# Altium project SSTU V3.0.PrjPCB
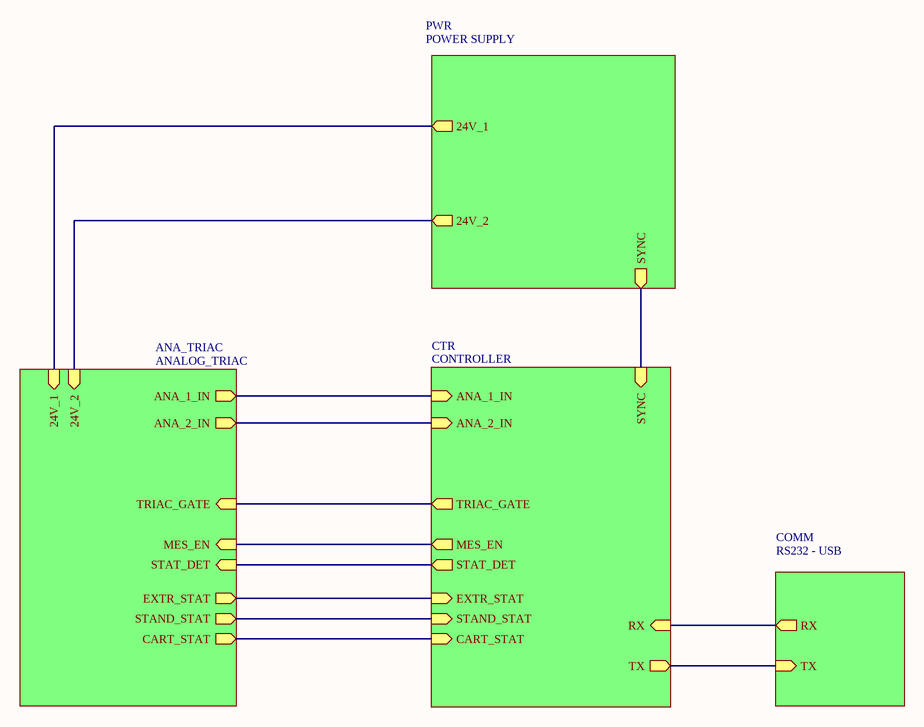
[diagram p0: Main.SchDoc]
4 sheets, 94 parts. Net scope: hierarchical (ports join the sheet entries above them; power ports are global).
Board file: SSTU V3.0.PcbDoc
Sheets:
  Main.SchDoc
    CTR = CONTROLLER.SchDoc
    PWR = POWER SUPPLY.SchDoc
    ANA_TRIAC = ANALOG_TRIAC.SchDoc

## Sheet Main.SchDoc
size A4

### Sub-sheets
ANA_TRIAC = ANALOG_TRIAC: ANA_1_IN (out), CART_STAT (out), ANA_2_IN (out), STAND_STAT (out), EXTR_STAT (out), STAT_DET (in), 24V_1 (in), 24V_2 (in), TRIAC_GATE (in), MES_EN (in)
COMM = RS232 - USB (file not in this document): RX (out), TX (in)
CTR = CONTROLLER: STAT_DET (out), ANA_1_IN (in), RX (in), TX (out), SYNC (in), ANA_2_IN (in), TRIAC_GATE (out), EXTR_STAT (in), STAND_STAT (in), CART_STAT (in), MES_EN (out)
PWR = POWER SUPPLY: SYNC (out), 24V_1 (out), 24V_2 (out)

### Nets
NetC208_1: sheet PWR/24V_1, sheet ANA_TRIAC/24V_1
NetC501_2: sheet CTR/ANA_2_IN, sheet ANA_TRIAC/ANA_2_IN
NetC507_2: sheet CTR/ANA_1_IN, sheet ANA_TRIAC/ANA_1_IN
NetD200_A: sheet PWR/24V_2, sheet ANA_TRIAC/24V_2
NetR201_2: sheet CTR/SYNC, sheet PWR/SYNC
NetR507_1: sheet CTR/TRIAC_GATE, sheet ANA_TRIAC/TRIAC_GATE
NetR522_2: sheet CTR/STAND_STAT, sheet ANA_TRIAC/STAND_STAT
NetR524_2: sheet CTR/CART_STAT, sheet ANA_TRIAC/CART_STAT
NetR526_2: sheet CTR/EXTR_STAT, sheet ANA_TRIAC/EXTR_STAT
NetU400_14: sheet CTR/MES_EN, sheet ANA_TRIAC/MES_EN
NetU400_32: sheet CTR/RX, sheet COMM/RX
NetU400_35: sheet CTR/TX, sheet COMM/TX
NetU400_37: sheet CTR/STAT_DET, sheet ANA_TRIAC/STAT_DET

## Sheet CONTROLLER.SchDoc
size A3
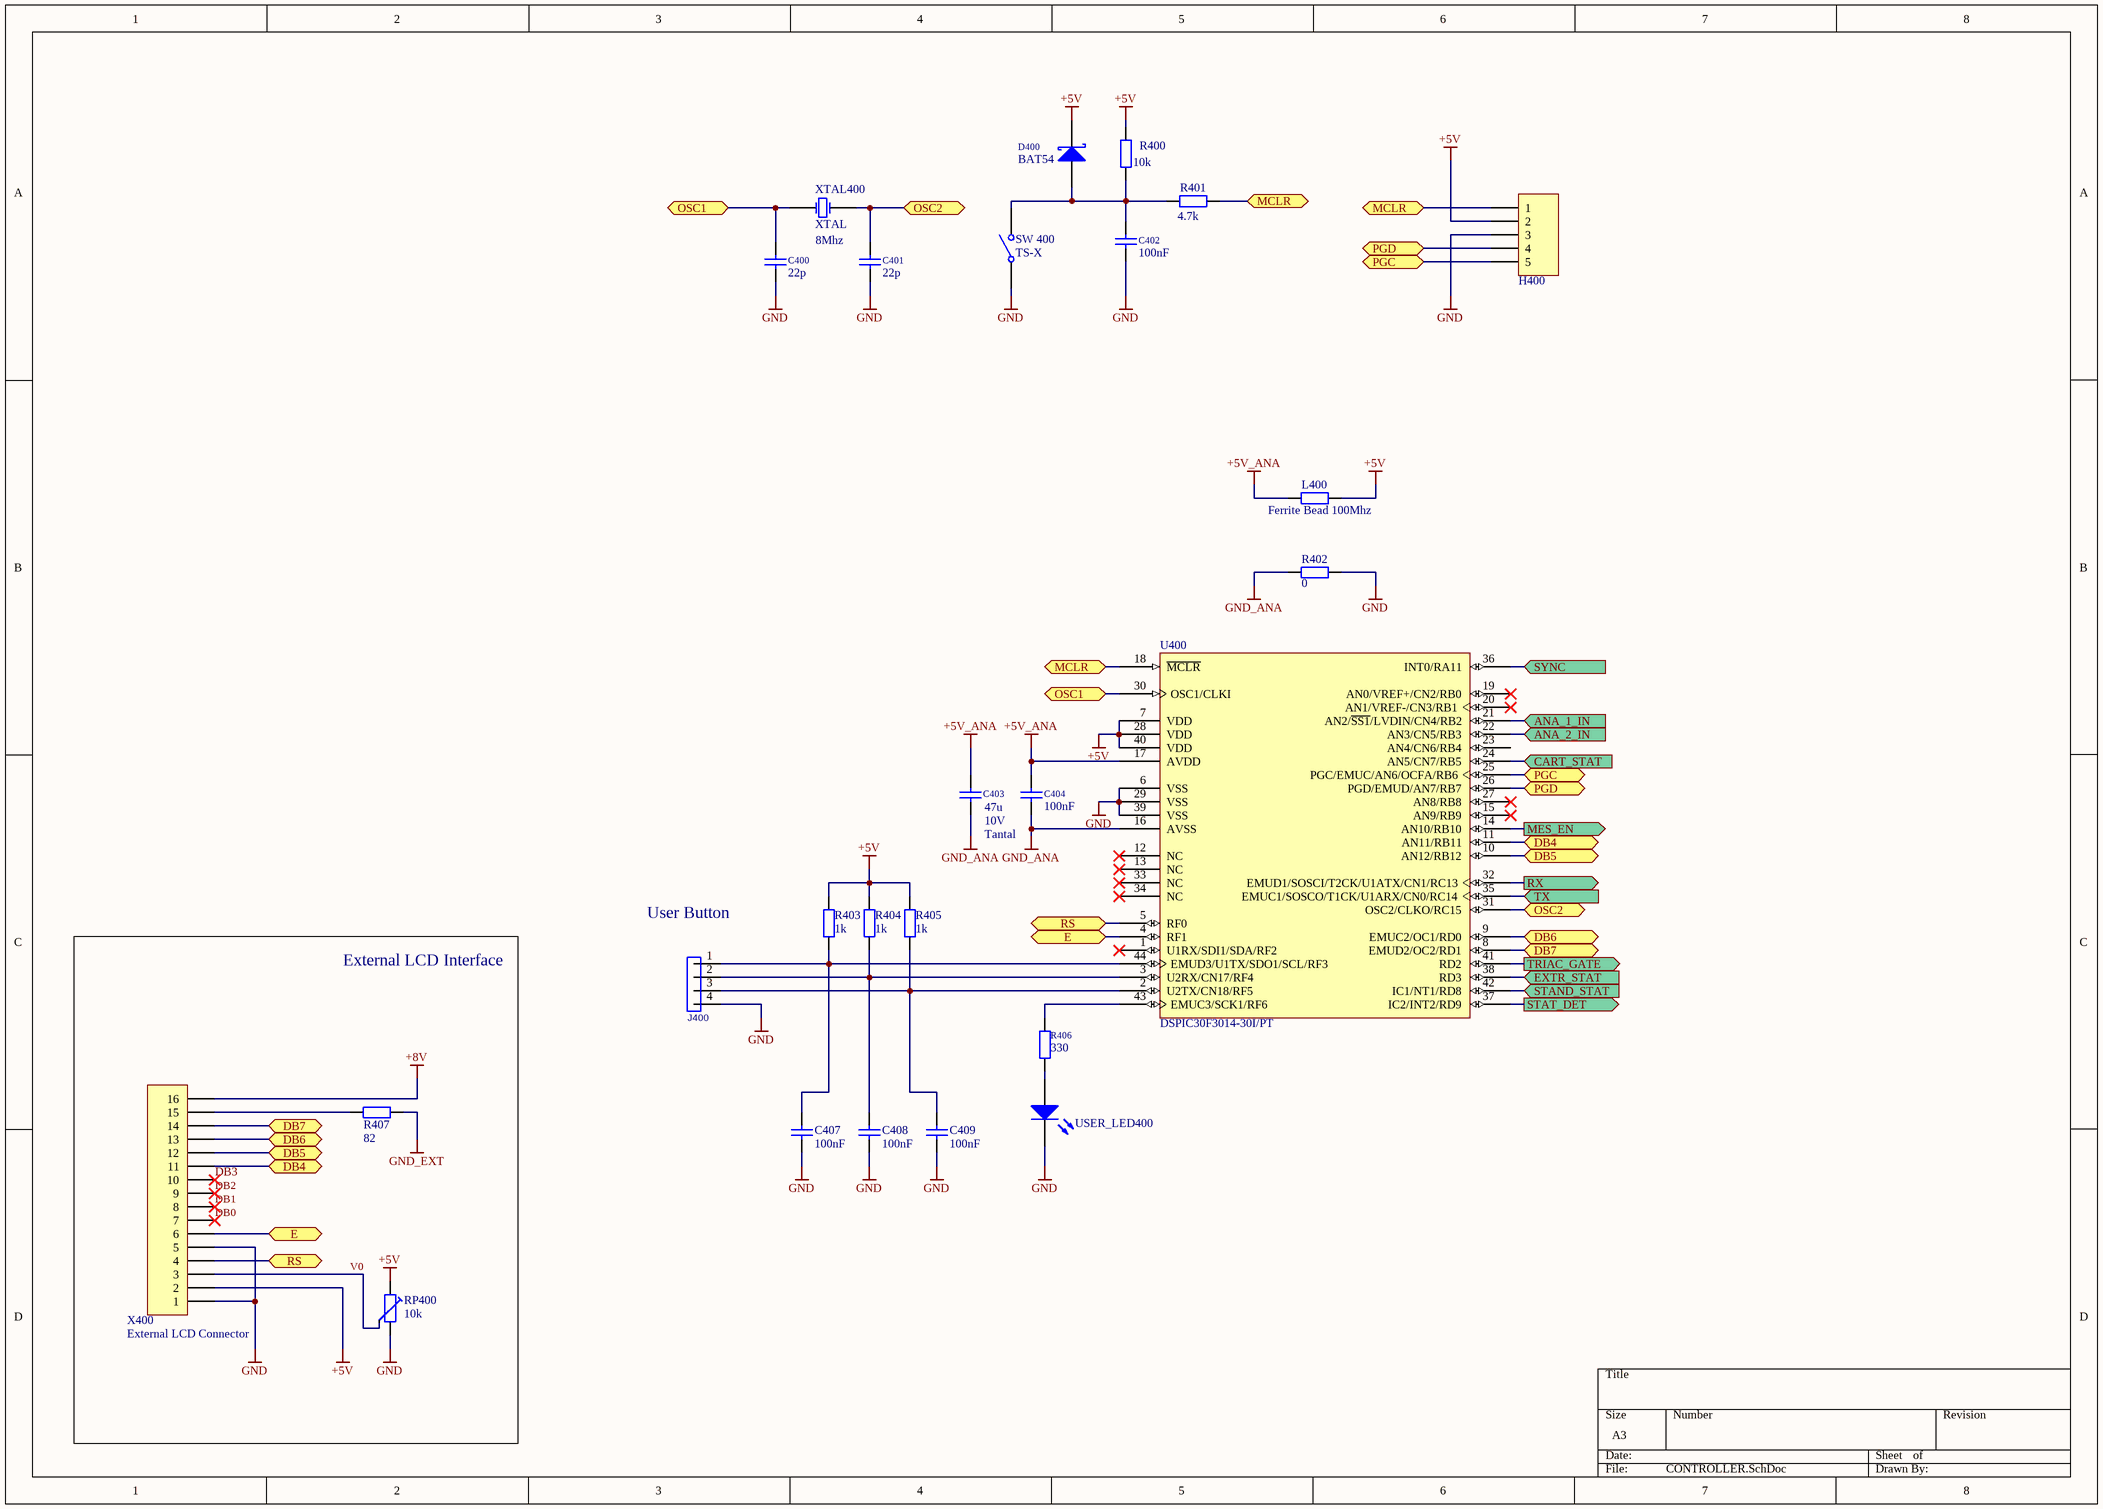
[diagram p1: CONTROLLER.SchDoc]

### Parts
C400  value 22p  [3216[1206]]  (hidden comment: Cap)
C401  value 22p  [3216[1206]]  (hidden comment: Cap)
C402  value 100nF  [3216[1206]]  (hidden comment: Cap)
C403  value 47u  Voltage: 10V  Type: Tantal  [3216[1206]]  (hidden comment: Cap)
C404  value 100nF  [3216[1206]]  (hidden comment: Cap)
C407  value 100nF  [3216[1206]]  (hidden comment: Cap 1206)
C408  value 100nF  [3216[1206]]  (hidden comment: Cap 1206)
C409  value 100nF  [3216[1206]]  (hidden comment: Cap 1206)
D400  BAT54  [SOT23]
H400  HEADER X5  [SIP5]  (value not drawn)
J400  SIP4  [SIP4]  (value not drawn)
L400  value Ferrite Bead 100Mhz  [3216[1206]]  (hidden comment: RES)
R400  value 10k  [3216[1206]]  (hidden comment: RES)
R401  value 4.7k  [3216[1206]]  (hidden comment: RES)
R402  value 0  [3216[1206]]  (hidden comment: RES)
R403  value 1k  [3216[1206]]  (hidden comment: RES)
R404  value 1k  [3216[1206]]  (hidden comment: RES)
R405  value 1k  [3216[1206]]  (hidden comment: RES)
R406  value 330  [3216[1206]]  (hidden comment: Resistor)
R407  value 82  [1206_REFLOW]  (hidden comment: RES)
RP400  value 10k  [BOURNS3296W]  (hidden comment: Trimmer)
SW_400  value TS-X  [TS Button]  (hidden comment: Tack Button 6x6)
U400  DSPIC30F3014-30I/PT  [TQFP-PT44_M]
USER_LED400  LED  [LED_1206]  (value not drawn)
X400  HEADER X16  [HDR1X16]  (value not drawn)
XTAL400  XTAL  value 8Mhz  [XTAL]

### Blocks framed on the sheet
External LCD Interface: R407 RP400 X400

### Ports
ANA_1_IN (in), ANA_2_IN (in), CART_STAT (in), DB4 (bidir), DB5 (bidir), DB6 (bidir), DB7 (bidir), E (bidir), EXTR_STAT (in), MCLR (bidir), MES_EN (out), OSC1 (bidir), OSC2 (bidir), PGC (bidir), PGD (bidir), RS (bidir), RX (out), STAND_STAT (in), STAT_DET (out), SYNC (in), TRIAC_GATE (out), TX (in)

### Nets
+5V: D400.3(K) H400.2 L400.2 R400.1 R403.2 R404.2 R405.2 RP400.3 U400.7(VDD) U400.28(VDD) U400.40(VDD) X400.2
+5V_ANA: C403.2 C404.2 L400.1 U400.17(AVDD)
+8V: X400.16
GND: C400.1 C401.1 C402.1 C407.1 C408.1 C409.1 H400.3 J400.4 R402.2 RP400.1 SW_400.1(COMMON) U400.6(VSS) U400.29(VSS) U400.39(VSS) USER_LED400.K X400.1 X400.5
GND_ANA: C403.1 C404.1 R402.1 U400.16(AVSS)
GND_EXT: R407.2
DB0: X400.7
DB1: X400.8
DB2: X400.9
DB3: X400.10
V0: RP400.2 X400.3
NetC400_2: C400.2 U400.30(OSC1/CLKI) XTAL400.1(OSC1) ; port OSC1
NetC401_2: C401.2 U400.31(OSC2/CLKO/RC15) XTAL400.2(OSC2) ; port OSC2
NetC402_2: C402.2 D400.1(A) R400.2 R401.1 SW_400.4(NO)
NetC407_2: C407.2 J400.1 R403.1 U400.44(EMUD3/U1TX/SDO1/SCL/RF3)
NetC408_2: C408.2 J400.2 R404.1 U400.3(U2RX/CN17/RF4)
NetC409_2: C409.2 J400.3 R405.1 U400.2(U2TX/CN18/RF5)
NetC501_2: U400.22(AN3/CN5/RB3) ; port ANA_2_IN
NetC507_2: U400.21(AN2/~{SS1}/LVDIN/CN4/RB2) ; port ANA_1_IN
NetH400_1: H400.1 R401.2 U400.18(~{MCLR}) ; port MCLR
NetH400_4: H400.4 U400.26(PGD/EMUD/AN7/RB7) ; port PGD
NetH400_5: H400.5 U400.25(PGC/EMUC/AN6/OCFA/RB6) ; port PGC
NetR201_2: U400.36(INT0/RA11) ; port SYNC
NetR406_1: R406.1 U400.43(EMUC3/SCK1/RF6)
NetR406_2: R406.2 USER_LED400.A
NetR407_1: R407.1 X400.15
NetR507_1: U400.41(RD2) ; port TRIAC_GATE
NetR522_2: U400.42(IC1/NT1/RD8) ; port STAND_STAT
NetR524_2: U400.24(AN5/CN7/RB5) ; port CART_STAT
NetR526_2: U400.38(RD3) ; port EXTR_STAT
NetU400_4: U400.4(RF1) X400.6 ; port E
NetU400_5: U400.5(RF0) X400.4 ; port RS
NetU400_8: U400.8(EMUD2/OC2/RD1) X400.14 ; port DB7
NetU400_9: U400.9(EMUC2/OC1/RD0) X400.13 ; port DB6
NetU400_10: U400.10(AN12/RB12) X400.12 ; port DB5
NetU400_11: U400.11(AN11/RB11) X400.11 ; port DB4
NetU400_14: U400.14(AN10/RB10) ; port MES_EN
NetU400_32: U400.32(EMUD1/SOSCI/T2CK/U1ATX/CN1/RC13) ; port RX
NetU400_35: U400.35(EMUC1/SOSCO/T1CK/U1ARX/CN0/RC14) ; port TX
NetU400_37: U400.37(IC2/INT2/RD9) ; port STAT_DET

Not connected (* = marked no-connect by the designer): U400 1(U1RX/SDI1/SDA/RF2)* 12(NC)* 13(NC)* 15(AN9/RB9)* 19(AN0/VREF+/CN2/RB0)* 20(AN1/VREF-/CN3/RB1)* 23(AN4/CN6/RB4) 27(AN8/RB8)* 33(NC)* 34(NC)*

### Notes on the sheet
- (near J400) User Button
- (near X400) External LCD Connector

### Library data of the parts
L400 R400-R405 R407 = RES 1
R406 = RES1
RP400 = Res Trim
SW_400 = TS-X Button
U400 = DSPIC30F3014-30I/PT: High-Performance 16-bit Digital Signal Controller, 24 KB Flash, 2 KB SRAM, 1 KB EEPROM, 44-Pin TQFP, Industrial Temperature; Published: 29-Jan-2009; DatasheetVersion: revF, Apr-2008; PackageVersion: revAW, Oct-2008; PackageReference: TQFP-PT44; Publisher: Altium Limited; PackageDescription: 44-Lead Plastic Thin Quad Flatpack (PT) - 10x10x1mm Body, 2.00mm [TQFP]; Code_JEDEC: MS-026; ComponentLink1Description: Manufacturer Link; ComponentLink1URL: http://www.microchip.com; ComponentLink2Description: Datasheet; ComponentLink2URL: http://ww1.microchip.com/downloads/en/DeviceDoc/70138F.pdf; ComponentLink3Description: Packaging Specification; ComponentLink3URL: http://ww1.microchip.com/downloads/en/PackagingSpec/00049AW.pdf
USER_LED400 = LED: Value: TBD
D400 = BAT54: Value: BAT54
H400 = HEADER X5: Value: HEADER X5
J400 = SIP4: Value: *
X400 = HEADER X16: Value: HEADER X16

## Sheet POWER SUPPLY.SchDoc
size A4
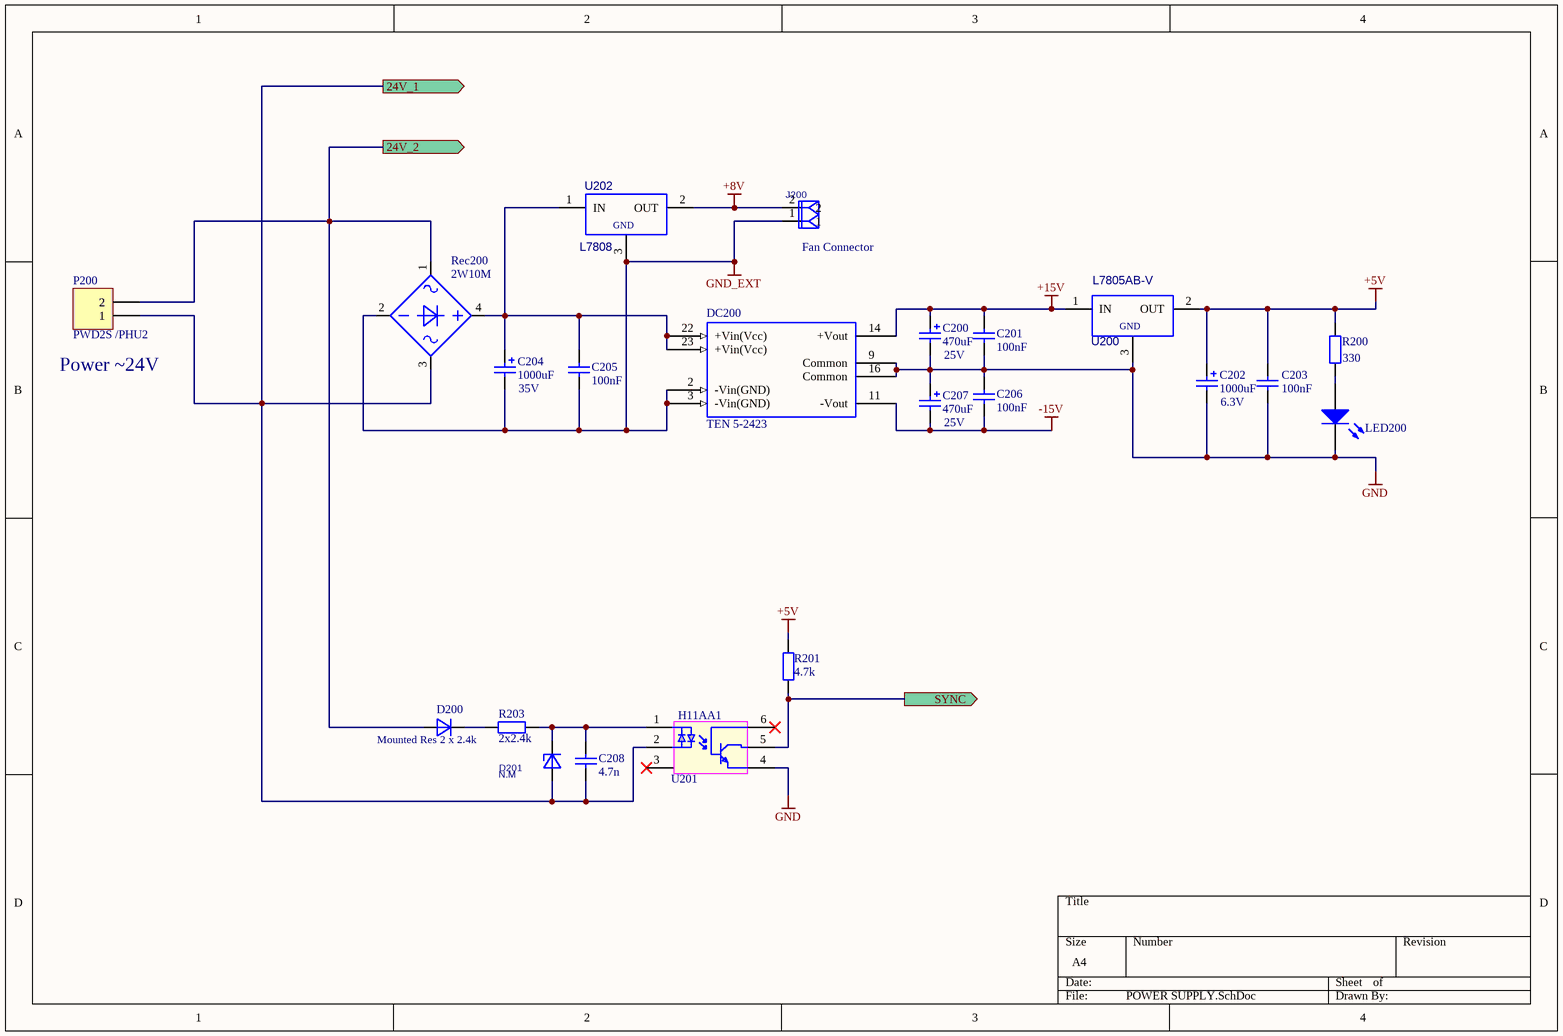
[diagram p2: POWER SUPPLY.SchDoc]

### Parts
C200  value 470uF  Voltage: 25V  [Cap Electrolyt 7]  (hidden comment: Cap)
C201  value 100nF  [3216[1206]]  (hidden comment: Cap 1206)
C202  value 1000uF  Voltage: 6.3V  [Cap Electrolyt 7]  (hidden comment: Cap)
C203  value 100nF  [3216[1206]]  (hidden comment: Cap 1206)
C204  value 1000uF  Voltage: 35V  [Cap Electrolyt 7]  (hidden comment: Cap)
C205  value 100nF  [3216[1206]]  (hidden comment: Cap 1206)
C206  value 100nF  [3216[1206]]  (hidden comment: Cap 1206)
C207  value 470uF  Voltage: 25V  [Cap Electrolyt 7]  (hidden comment: Cap)
C208  value 4.7n  [3216[1206]]  (hidden comment: Cap 1206)
D200  value Mounted Res 2 x 2.4k  [D_MINIMELF_LL4148]  (hidden comment: LL4148)
D201  value N.M  [D_MINIMELF_BZV55C5V1(Primary)]  (hidden comment: BZV55C5V1)
DC200  TEN 5-2423  [DIP24_TRACO]
J200  SIP2  [SIP2]  (value not drawn)
LED200  LED  [LED_1206]  (value not drawn)
P200  PWD2S /PHU2  [PWD2S /PHU2]
R200  value 330  [3216[1206]]  (hidden comment: RES)
R201  value 4.7k  [3216[1206]]  (hidden comment: RES)
R203  value 2x2.4k  [3216[1206]]  (hidden comment: RES)
Rec200  2W10M  [WOB_2WXX[X]M]
U200  value L7805AB-V  [SFM-T3/E10.4V_L7805AC-V(Primary)]  (hidden comment: L7805AC-V)
U201  H11AA1  [DIP6]
U202  value L7808  [SFM-T3/E10.4V_L7805AC-V(Primary)]  (hidden comment: L7805AC-V)

### Ports
24V_1 (out), 24V_2 (out), SYNC (out)

### Nets
+5V: C202.1 C203.2 R200.1 R201.1 U200.2(OUT)
+8V: J200.2 U202.2(OUT)
+15V: C200.1 C201.2 DC200.14(+Vout) U200.1(IN)
-15V: C206.1 C207.2 DC200.11(-Vout)
GND: C200.2 C201.1 C202.2 C203.1 C206.2 C207.1 DC200.9(Common) DC200.16(Common) LED200.K U200.3(GND) U201.4
GND_EXT: C204.2 C205.1 DC200.2(-Vin(GND)) DC200.3(-Vin(GND)) J200.1 Rec200.2(-) U202.3(GND)
NetC204_1: C204.1 C205.2 DC200.22(+Vin(Vcc)) DC200.23(+Vin(Vcc)) Rec200.4(+) U202.1(IN)
NetC208_1: C208.1 D201.A P200.1 Rec200.3(AC2) U201.2 ; port 24V_1
NetC208_2: C208.2 D201.K R203.2 U201.1
NetD200_A: D200.A P200.2 Rec200.1(AC1) ; port 24V_2
NetD200_K: D200.K R203.1
NetLED200_A: LED200.A R200.2
NetR201_2: R201.2 U201.5 ; port SYNC

Not connected (* = marked no-connect by the designer): U201 3* 6*

### Notes on the sheet
- (near J200) Fan Connector
- (near P200) Power |4V

### Library data of the parts
C200 C202 C204 C207 = Cap pol
D201 = BZV55C5V1: Voltage regulator diode; Manufacturer: Any; Group: Discrete; Subgroup1: Zener; Subgroup: Diode; Package: SOD80C; Mounting: SMD
LED200 = LED: Value: TBD
R200 R201 R203 = RES 1
Rec200 = 2W10M: Description: Rectifier; Value: 2W10M
U200 = L7805AC-V: Precision 1A Regulator; ComponentField6: Tab is connected to pin 3 (GND).; ComponentField7: Published 24-Aug-2001; OriginalName: L7805AB-V
U202 = L7805AC-V: Precision 1A Regulator; OriginalName: L7805AB-V; ComponentField6: Tab is connected to pin 3 (GND).; ComponentField7: Published 24-Aug-2001
DC200 = TEN 5-2423: Value: TEN 5-2423
J200 = SIP2: Value: *
P200 = PWD2S /PHU2: Value: PWD2S /PHU2
U201 = H11AA1: Value: H11AA1

## Sheet ANALOG_TRIAC.SchDoc
size A3
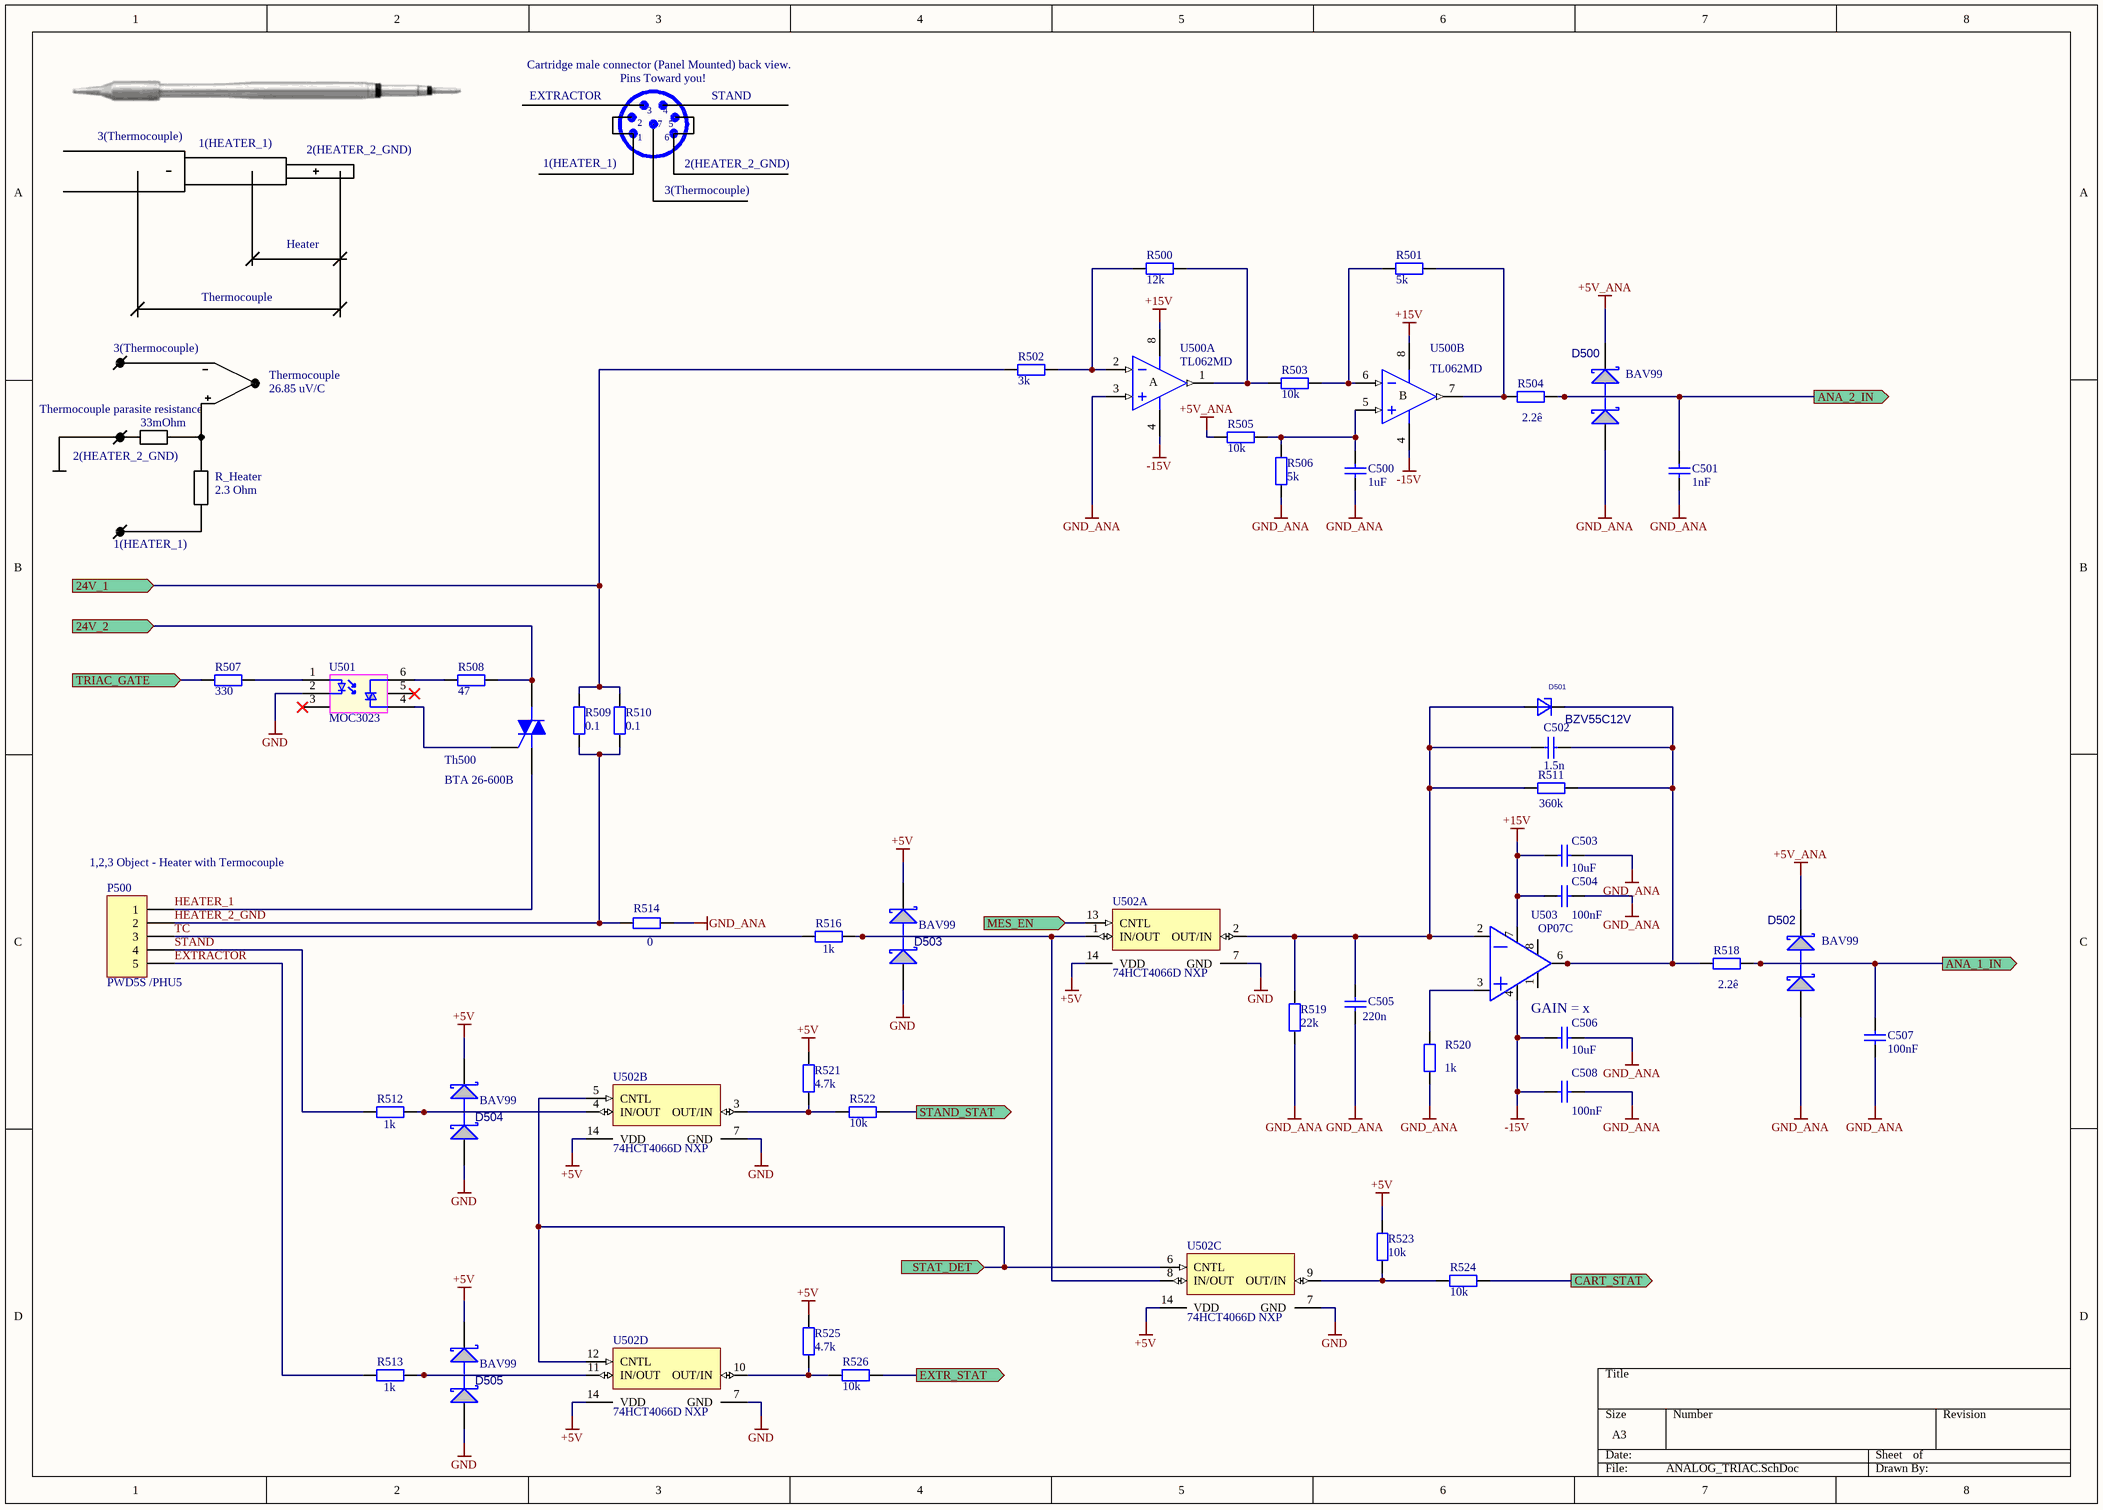
[diagram p3: ANALOG_TRIAC.SchDoc]

### Parts
C500  value 1uF  [3216[1206]]  (hidden comment: Cap 1206)
C501  value 1nF  [3216[1206]]  (hidden comment: Cap 1206)
C502  value 1.5n  [3216[1206]]  (hidden comment: Cap 1206)
C503  value 10uF  [3216[1206]]  (hidden comment: Cap 1206)
C504  value 100nF  [3216[1206]]  (hidden comment: Cap 1206)
C505  value 220n  [3216[1206]]  (hidden comment: Cap 1206)
C506  value 10uF  [3216[1206]]  (hidden comment: Cap 1206)
C507  value 100nF  [3216[1206]]  (hidden comment: Cap 1206)
C508  value 100nF  [3216[1206]]  (hidden comment: Cap 1206)
D500  value BAV99  [SOT23_HIS_Primary]  (hidden comment: BAT64-04)
D501  BZV55C12V  [D_MINIMELF_BZV55C12V(Primary)]
D502  value BAV99  [SOT23_HIS_Primary]  (hidden comment: BAT64-04)
D503  value BAV99  [SOT23_HIS_Primary]  (hidden comment: BAT64-04)
D504  value BAV99  [SOT23_HIS_Primary]  (hidden comment: BAT64-04)
D505  value BAV99  [SOT23_HIS_Primary]  (hidden comment: BAT64-04)
P500  PWD5S /PHU5  [PWD5S/ PHU5]
R500  value 12k  [1206_REFLOW]  (hidden comment: RES)
R501  value 5k  [1206_REFLOW]  (hidden comment: RES)
R502  value 3k  [1206_REFLOW]  (hidden comment: RES)
R503  value 10k  [1206_REFLOW]  (hidden comment: RES)
R504  value 2.2ê  [3216[1206]]  (hidden comment: RES)
R505  value 10k  [1206_REFLOW]  (hidden comment: RES)
R506  value 5k  [1206_REFLOW]  (hidden comment: RES)
R507  value 330  [3216[1206]]  (hidden comment: RES)
R508  value 47  [3216[1206]]  (hidden comment: RES)
R509  value 0.1  [RA161004]  (hidden comment: RES)
R510  value 0.1  [RA161004]  (hidden comment: RES)
R511  value 360k  [3216[1206]]  (hidden comment: RES)
R512  value 1k  [3216[1206]]  (hidden comment: RES)
R513  value 1k  [3216[1206]]  (hidden comment: RES)
R514  value 0  [1206_REFLOW]  (hidden comment: RES)
R516  value 1k  [3216[1206]]  (hidden comment: RES)
R518  value 2.2ê  [3216[1206]]  (hidden comment: RES)
R519  value 22k  [3216[1206]]  (hidden comment: RES)
R520  value 1k  [3216[1206]]  (hidden comment: RES)
R521  value 4.7k  [3216[1206]]  (hidden comment: RES)
R522  value 10k  [3216[1206]]  (hidden comment: RES)
R523  value 10k  [3216[1206]]  (hidden comment: RES)
R524  value 10k  [3216[1206]]  (hidden comment: RES)
R525  value 4.7k  [3216[1206]]  (hidden comment: RES)
R526  value 10k  [3216[1206]]  (hidden comment: RES)
Th500  BTA 26-600B  [TO247]
U500  TL062MD  [SO8_N]  (parts A,B of 2)
U501  MOC3023  [DIP-6]
U502  74HCT4066D NXP  [SO14_N]  (parts A,B,C,D of 4)
U503  OP07C  [SO8]

### Ports
24V_1 (in), 24V_2 (in), ANA_1_IN (out), ANA_2_IN (out), CART_STAT (out), EXTR_STAT (out), MES_EN (in), STAND_STAT (out), STAT_DET (in), TRIAC_GATE (in)

### Nets
+5V: D503.2(K) D504.2(K) D505.2(K) R521.2 R523.2 R525.2 U502.14(VDD)  [also labelled VDD]
+5V_ANA: D500.2(K) D502.2(K) R505.1
+15V: C503.2 C504.2 U500.8(V+) U503.7
-15V: C506.2 C508.2 U500.4(V-) U503.4
GND: D503.1(A) D504.1(A) D505.1(A) U501.2 U502.7(GND)
GND_ANA: C500.1 C501.1 C503.1 C504.1 C505.1 C506.1 C507.1 C508.1 D500.1(A) D502.1(A) R506.1 R514.2 R519.2 R520.2 U500.3(IN+)
EXTRACTOR: P500.5 R513.1
HEATER_1: P500.1 Th500.1
HEATER_2_GND: P500.2 R509.2 R510.2 R514.1
STAND: P500.4 R512.1
TC: P500.3 R516.1
NetC208_1: R502.1 R509.1 R510.1 ; port 24V_1
NetC500_2: C500.2 R505.2 R506.2 U500.5(IN+)
NetC501_2: C501.2 D500.3(C) R504.2 ; port ANA_2_IN
NetC502_1: C502.1 D501.K R511.2 R518.1 U503.6
NetC502_2: C502.2 C505.2 D501.A R511.1 R519.1 U502.2(OUT/IN) U503.2
NetC507_2: C507.2 D502.3(C) R518.2 ; port ANA_1_IN
NetD200_A: R508.2 Th500.2 ; port 24V_2
NetD503_3: D503.3(C) R516.2 U502.1(IN/OUT) U502.8(IN/OUT)
NetD504_3: D504.3(C) R512.2 U502.4(IN/OUT)
NetD505_3: D505.3(C) R513.2 U502.11(IN/OUT)
NetR500_1: R500.1 R502.2 U500.2(IN-)
NetR500_2: R500.2 R503.1 U500.1(OUT)
NetR501_1: R501.1 R503.2 U500.6(IN-)
NetR501_2: R501.2 R504.1 U500.7(OUT)
NetR507_1: R507.1 ; port TRIAC_GATE
NetR507_2: R507.2 U501.1
NetR508_1: R508.1 U501.6
NetR520_1: R520.1 U503.3
NetR521_1: R521.1 R522.1 U502.3(OUT/IN)
NetR522_2: R522.2 ; port STAND_STAT
NetR523_1: R523.1 R524.1 U502.9(OUT/IN)
NetR524_2: R524.2 ; port CART_STAT
NetR525_1: R525.1 R526.1 U502.10(OUT/IN)
NetR526_2: R526.2 ; port EXTR_STAT
NetTh500_3: Th500.3 U501.4
NetU400_14: U502.13(CNTL) ; port MES_EN
NetU400_37: U502.5(CNTL) U502.6(CNTL) U502.12(CNTL) ; port STAT_DET

Not connected (* = marked no-connect by the designer): U501 3* 5*; U503 1 8

### Notes on the sheet
- Cartridge male connector (Panel Mounted) back view.
- EXTRACTOR
- Pins Toward you!
- 3
- 4
- STAND
- 3(Thermocouple)
- 1(HEATER_1)
- 2(HEATER_2_GND)
- 1
- 2
- 7
- 6
- 5
- Heater
- Thermocouple
- Thermocouple parasite resistance
- 33mOhm
- 26.85 uV/C
- 2.3 Ohm
- R_Heater
- (near P500) 1,2,3 Object - Heater with Termocouple
- GAIN = x
- (in symbol TL062MD, part A) A
- (in symbol TL062MD, part B) B

### Library data of the parts
D500 D502-D505 = BAT64-04: Silicon Schottky Diodes; Manufacturer: INF; ComponentLink1DescBC: Manufacturer Link; Group: Discrete; Subgroup: Diode; Published: 21-Mar-2003; DatasheetDocument: Oct-1999; PackageDocument: Sep-2001; PackageReference: SOT-23; Publisher: Altium Limited; ComponentLink1URL: http://www.infineon.com/
R500-R514 R516 R518-R526 = RES 1
U500 = TL062MD: Low-Power J-FET Dual Bipolar Operational Amplifier; Published: 24-Aug-2001; LatestRevisionDate: 13-Apr-2006; LatestRevisionNote: IPC-7351 Footprint Added.; DatasheetVersion: Oct-1997; PackageVersion: Dec-2002; PackageReference: SO8; Publisher: Altium Limited; PackageDescription: 8-Pin Small Outline Integrated Circuit 1.27 mm Pitch; Code_JEDEC: MS-012-AA; Code_IPC: SOIC127P600-8; ComponentLink1Description: Manufacturer Link; ComponentLink1URL: http://www.st.com/; ComponentLink2Description: Datasheet; ComponentLink2URL: http://www.st.com/stonline/products/literature/ds/2294/tl062.pdf
U502 = HCF4066BM1: Quad Bilateral Switch For Transmission or Multiplexing of Analog or Digital Signals; Published: 8-Jun-2000; LatestRevisionDate: 13-Apr-2006; LatestRevisionNote: IPC-7351 Footprint Added.; DatasheetVersion: Jun-1989; PackageVersion: Sep-1998; PackageReference: SO14; Publisher: Altium Limited; PackageDescription: 14-Pin Small Outline Integrated Circuit 1.27 mm Pitch; Code_IPC: SOIC127P600-14; ComponentLink1Description: Manufacturer Link; ComponentLink1URL: http://www.st.com/; ComponentLink2Description: Datasheet; ComponentLink2URL: http://www.st.com/stonline/products/literature/ds/2057/hcf4066.pdf
D501 = BZV55C12V: Value: BZV55C12V
P500 = PWD5S /PHU5: Value: PWD5S /PHU5
Th500 = BTA 26-600B: Value: BTA 26-600B
U501 = MOC3023: Value: MOC3023
U503 = OP07C: Value: OP07C

## Nets that join several sheets
+5V: CONTROLLER (12 pins), POWER SUPPLY (5 pins), ANALOG_TRIAC (7 pins)
+5V_ANA: CONTROLLER (C403.2 C404.2 L400.1 U400.17), ANALOG_TRIAC (D500.2 D502.2 R505.1)
+8V: CONTROLLER (X400.16), POWER SUPPLY (J200.2 U202.2)
+15V: POWER SUPPLY (C200.1 C201.2 DC200.14 U200.1), ANALOG_TRIAC (C503.2 C504.2 U500.8 U503.7)
-15V: POWER SUPPLY (C206.1 C207.2 DC200.11), ANALOG_TRIAC (C506.2 C508.2 U500.4 U503.4)
GND: CONTROLLER (17 pins), POWER SUPPLY (11 pins), ANALOG_TRIAC (5 pins)
GND_ANA: CONTROLLER (C403.1 C404.1 R402.1 U400.16), ANALOG_TRIAC (15 pins)
GND_EXT: CONTROLLER (R407.2), POWER SUPPLY (7 pins)
NetC208_1: POWER SUPPLY (5 pins), ANALOG_TRIAC (R502.1 R509.1 R510.1)
NetC501_2: CONTROLLER (U400.22), ANALOG_TRIAC (C501.2 D500.3 R504.2)
NetC507_2: CONTROLLER (U400.21), ANALOG_TRIAC (C507.2 D502.3 R518.2)
NetD200_A: POWER SUPPLY (D200.A P200.2 Rec200.1), ANALOG_TRIAC (R508.2 Th500.2)
NetR201_2: CONTROLLER (U400.36), POWER SUPPLY (R201.2 U201.5)
NetR507_1: CONTROLLER (U400.41), ANALOG_TRIAC (R507.1)
NetR522_2: CONTROLLER (U400.42), ANALOG_TRIAC (R522.2)
NetR524_2: CONTROLLER (U400.24), ANALOG_TRIAC (R524.2)
NetR526_2: CONTROLLER (U400.38), ANALOG_TRIAC (R526.2)
NetU400_14: CONTROLLER (U400.14), ANALOG_TRIAC (U502.13)
NetU400_37: CONTROLLER (U400.37), ANALOG_TRIAC (U502.5 U502.6 U502.12)